# EasyEDA schematic SCH_rangkaianHotWheels.json
TITLE: LED HotWheels; REV: 1.0; Date: 2025-02-12; Sheet: 1/1; Drawn By: mtsnzaki2002; Company: Hertzampere
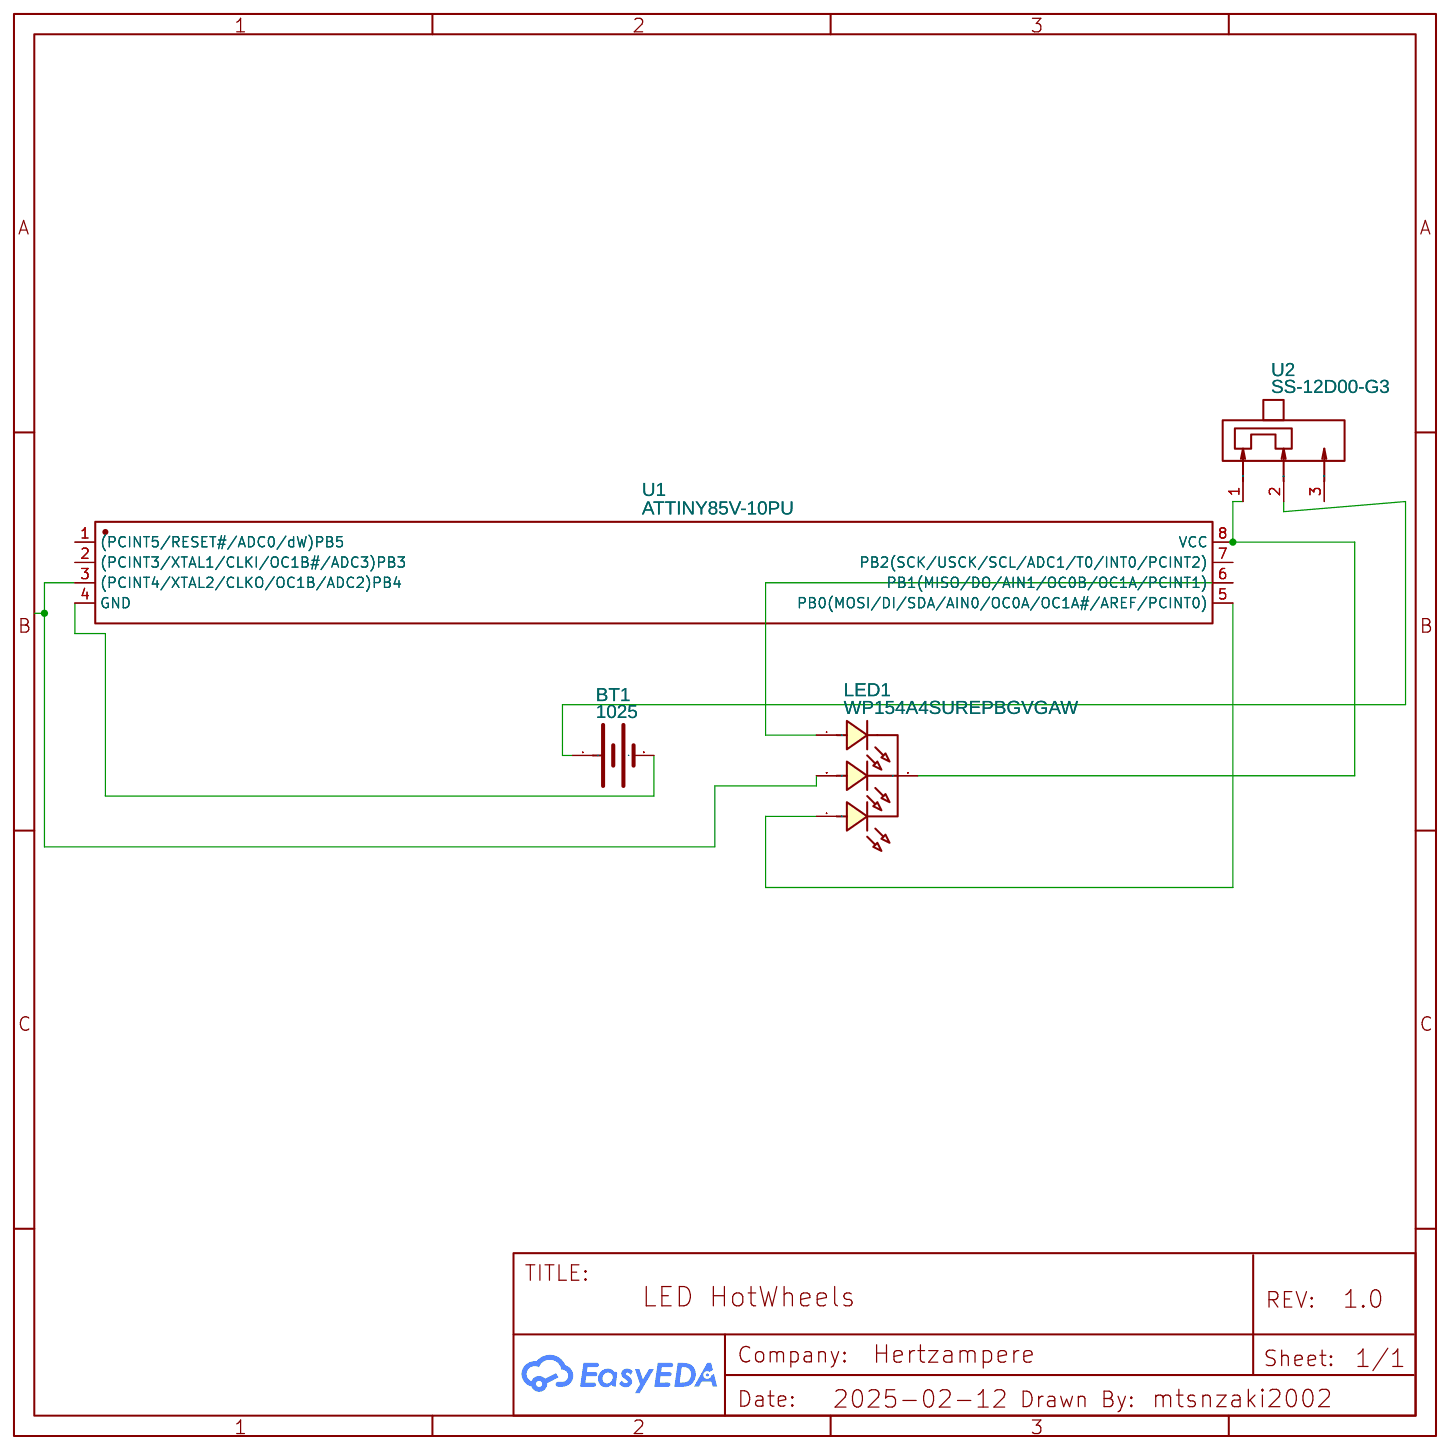
[diagram p0: schematic sheet]

## Parts
BT1  1025  [BAT-TH_KEYSTONE-1025]
LED1  WP154A4SUREPBGVGAW  [LED-TH_4P-BD5.8-P1.27_WS2812D-F5-12MA-C1]
U1  ATTINY85V-10PU  [PDIP-8_L9.6-W6.4-P2.54-LS7.6-BL]
U2  SS-12D00-G3  [SW-TH_3P-L8.8-W3.9-P2.50_SS12D00G3]

## Library data of the parts
BT1 = 1025: Contributor: LCSC; Supplier: LCSC; Supplier Part: C238060; Manufacturer: Keystone; JLCPCB Part Class: Extended Part
LED1 = WP154A4SUREPBGVGAW: Supplier: LCSC; Supplier Part: C19507719; Manufacturer: Kingbright; JLCPCB Part Class: Extended Part; Contributor: lcsc
U1 = ATTINY85V-10PU: Contributor: LCSC; Supplier: LCSC; Supplier Part: C1339742; Manufacturer: MICROCHIP(美国微芯); JLCPCB Part Class: Extended Part
U2 = SS-12D00-G3: Supplier: LCSC; Supplier Part: C22355741; Manufacturer: SOFNG(硕方); Contributor: lcsc; JLCPCB Part Class: Extended Part

## Nets
Net-(BT1-1): BT1.1(+) U2.2
Net-(BT1-2): BT1.2(-) U1.4(GND)
Net-(LED1-1): LED1.1(A) U1.5(PB0(MOSI/DI/SDA/AIN0/OC0A/OC1A#/AREF/PCINT0))
Net-(LED1-2): LED1.2(K) U1.8(VCC) U2.1
Net-(LED1-3): LED1.3(A) U1.3((PCINT4/XTAL2/CLKO/OC1B/ADC2)PB4)
Net-(LED1-4): LED1.4(A) U1.6(PB1(MISO/DO/AIN1/OC0B/OC1A/PCINT1))

Not connected (* = marked no-connect by the designer): U1 1((PCINT5/RESET#/ADC0/dW)PB5) 2((PCINT3/XTAL1/CLKI/OC1B#/ADC3)PB3) 7(PB2(SCK/USCK/SCL/ADC1/T0/INT0/PCINT2)); U2 3
